# Altium schematic sheet ADC.SchDoc
size A
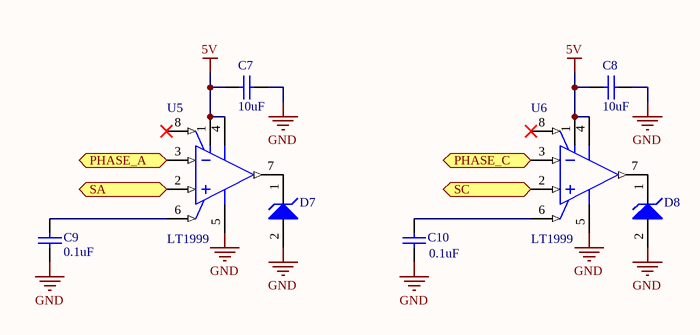
[diagram p0: ADC.SchDoc]

## Parts
C7  10uF  [CAPC0603(1608)100_M]
C8  10uF  [CAPC0603(1608)100_N]
C9  0.1uF  [CAPC0603(1608)100_L]
C10  0.1uF  [CAPC0603(1608)100_L]
D7  (no value)  [ONSC-SOD-323-2-477-02_V]
D8  (no value)  [ONSC-SOD-323-2-477-02_V]
U5  LT1999  [LT-MS8-8_N]
U6  LT1999  [LT-MS8-8_N]

## Ports
PHASE_A (in), PHASE_C (in), SA (in), SC (in)

## Nets
5V: C7.1 C8.1 U5.1(V+) U5.4(V+) U6.1(V+) U6.4(V+)
GND: C7.2 C8.2 C9.1 C10.1 D7.2(A) D8.2(A) U5.5(GND) U6.5(GND)
PHASE_A: U5.3(-IN) ; port PHASE_A
PHASE_C: U6.3(-IN) ; port PHASE_C
SA: U5.2(+IN) ; port SA
SC: U6.2(+IN) ; port SC
NetC9_2: C9.2 U5.6(REF)
NetC10_2: C10.2 U6.6(REF)
NetD7_1: D7.1(K) U5.7(OUT)
NetD8_1: D8.1(K) U6.7(OUT)

Not connected (* = marked no-connect by the designer): U5 8(~{SHDN})*; U6 8(~{SHDN})*

## Library data of the parts
C7 = CMP-1035-02796-1: CAP 10uF 6.3V Â±10% 0603 (1608 Metric) Thickness 1mm SMD; Case-EIA: 0603; Case-Metric: 1608; Tolerance: Â±10%; Value: 10uF; Technology: SMT; Rated Voltage: 6.3 V; Max Thickness: 1 mm
C8 = CMP-1035-02797-1: CAP 10uF 6.3V Â±20% 0603 (1608 Metric) Thickness 1mm SMD; Case-Metric: 1608; Case-EIA: 0603; Value: 10uF; Technology: SMT; Tolerance: Â±20%; Max Thickness: 1 mm; Rated Voltage: 6.3 V
C9 C10 = CMP-1035-02577-1: CAP 100nF 6.3V Â±20% 0603 (1608 Metric) Thickness 1mm SMD; Case-EIA: 0603; Case-Metric: 1608; Technology: SMT; Rated Voltage: 6.3 V; Value: 100nF; Max Thickness: 1 mm; Tolerance: Â±20%
D7 D8 = CMP-1060-00652-1: Zener Voltage Regulator, 300 mW, Tight Tolerance Portfolio, 2-Pin SOD-323, Pb-Free, Tape and Reel; PartNumber: MM3Z3V3ST1G; Manufacturer: On Semiconductor; P Max (W): 0.3; DatasheetVersion: Rev. 21; PackageVersion: Rev. H, 03/2007; Packing: Tape and Reel; PackageReference: SOD-323-2-477-02; RoHS: Pb-Free; Mounting Technology: Surface Mount; ComponentLink2URL: http://www.onsemi.cn/pub_link/Collateral/MM3Z2V4ST1-D.PDF; ComponentLink1URL: http://www.onsemi.com/; ComponentLink2Description: Datasheet; ComponentLink1Description: Manufacturer URL; ComponentLink3Description: Package Specification; PackageDescription: 2-Pin SOD, Body 1.7 x 1.25 mm; ComponentLink3URL: http://www.onsemi.com/pub_link/Collateral/477-02.PDF.1
U5 U6 = CMP-0359-00619-2: Single Channel, High Voltage, Bidirectional Current Sense Amplifier, 2 MHz Typical GBW, 3 V/us Typical SR, 4.5 to 5.5 V, 8-Pin SOP (MS8-8), High Temperature / Automotive, Pb-Free, Reel; Manufacturer: Linear Technology; PartNumber: LT1999HMS8-20#TRPBF; Linear Technology Part Number: LT1999-20; Is (mA) Typical: 1.55; SR (V/us) Typical: 3; Channels (#): 1; Vs Max (V): 5.5; GBW (MHz) Typical: 2; Vs Min (V): 4.5; Vos (mV) Typical: 0.5; ComponentLink2Description: Datasheet; DatasheetVersion: Rev. B; PackageVersion: Rev G; ComponentLink3Description: Package Specification; ComponentLink2URL: http://cds.linear.com/docs/en/datasheet/1999fb.pdf; PackageReference: LT-MS8-8; PackageDescription: 8-Lead Plastic Small Outline, Body 3.9 x 4.9 mm, Pitch 1.27 mm; RevisionNote: URLs updated; Type: CSA; RoHS: Pb-Free; ComponentLink1URL: http://www.linear.com/; Packing: Reel; ComponentLink3URL: http://cds.linear.com/docs/en/packaging/05081610_G_SO8.pdf; ComponentLink1Description: Manufacturer URL; Mounting Technology: Surface Mount